# EAGLE design petdoor_ctrl (EAGLE 5.09)
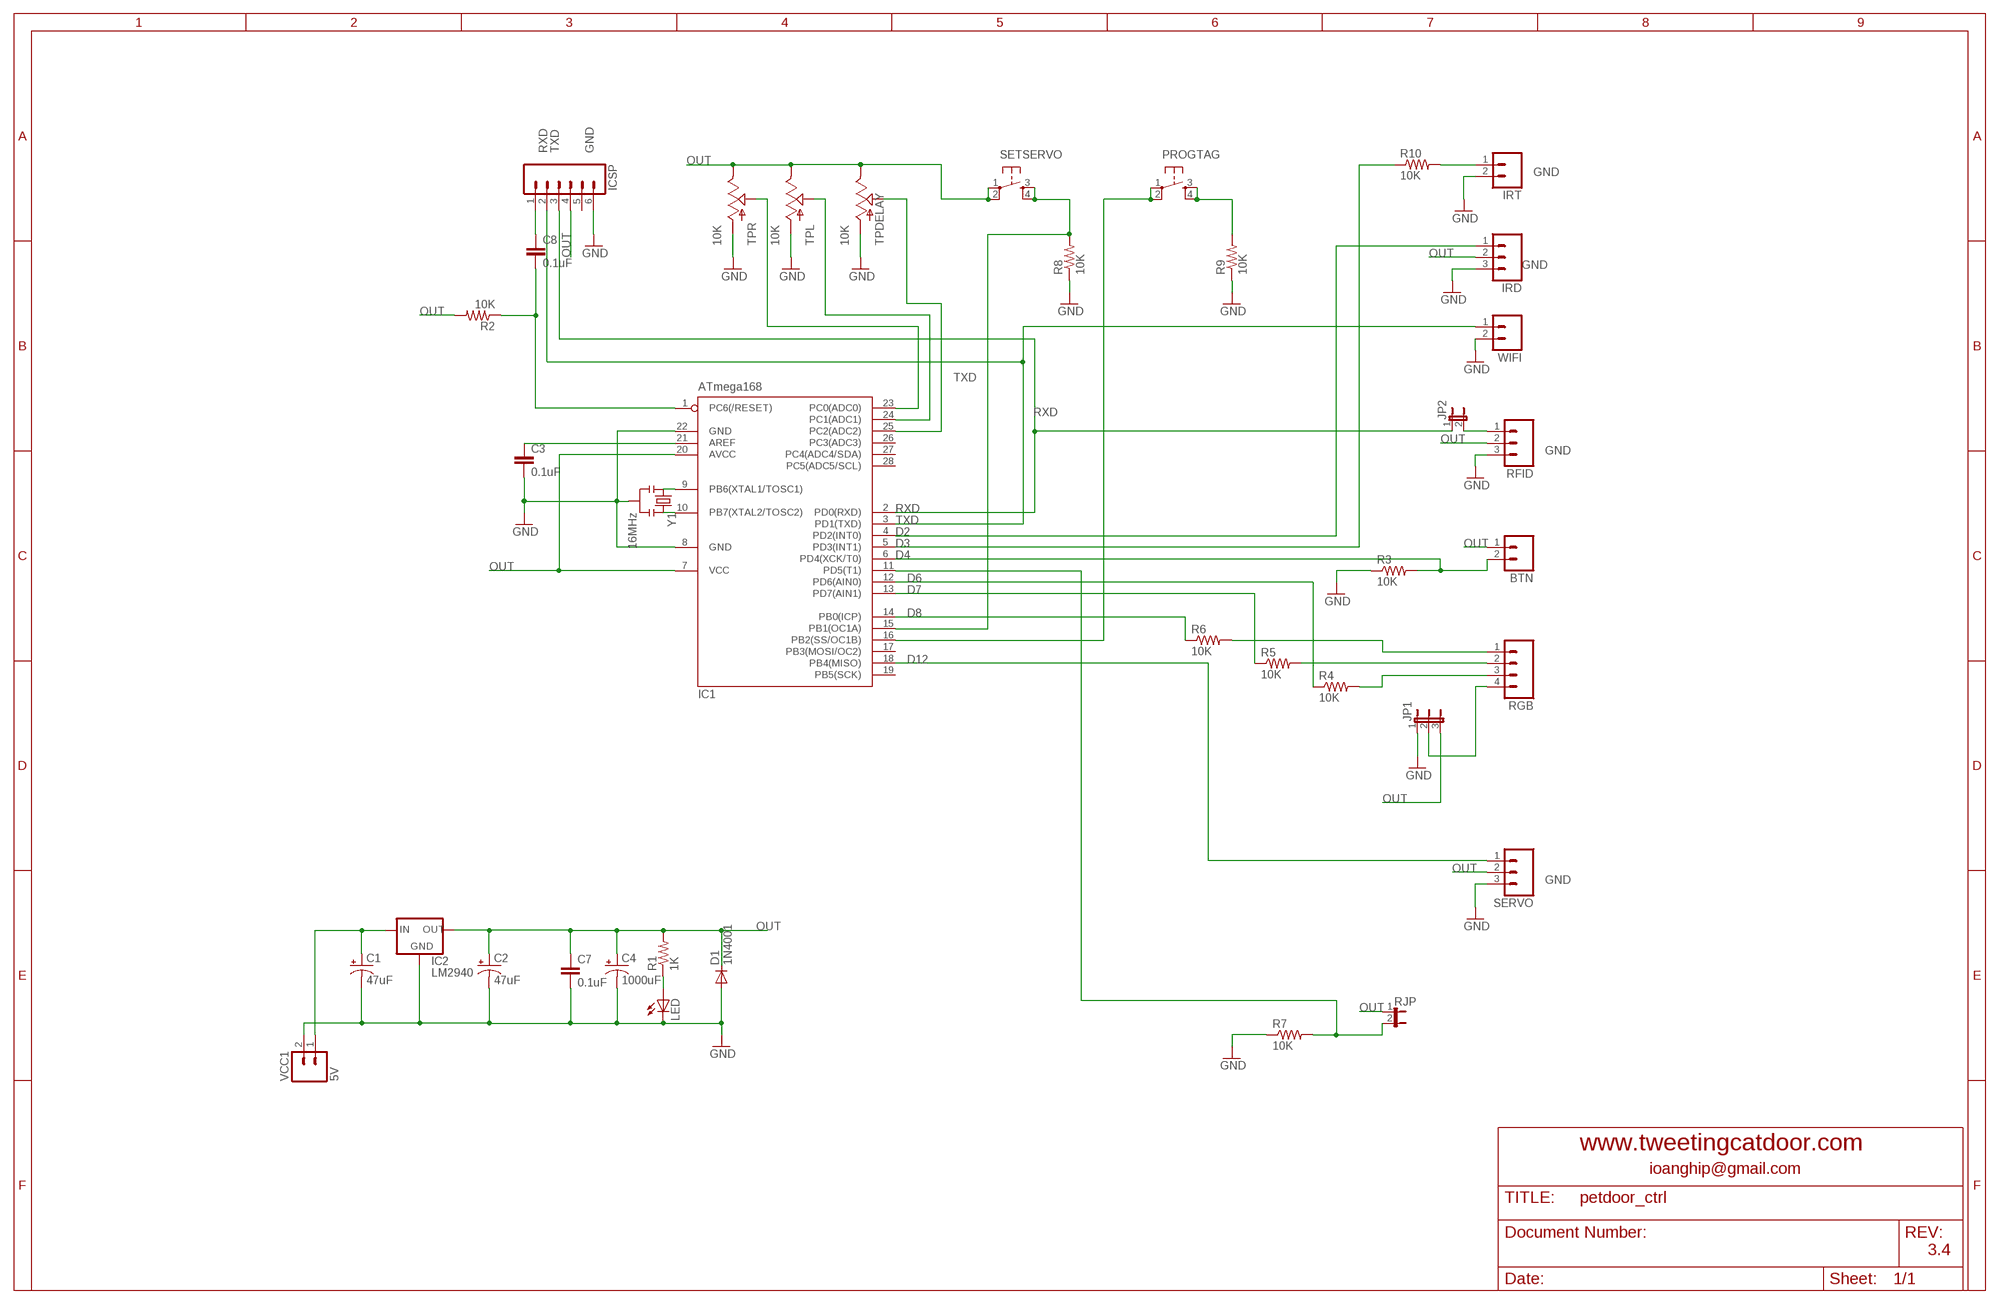
[diagram p0: schematic, sheet 1]

## Parts
BTN  M02POLAR_LOCK  [MOLEX-1X2_LOCK]
C1  47uF  CAP_POLPTH1  [CPOL-RADIAL-100UF-25V]
C2  47uF  CAP_POLPTH1  [CPOL-RADIAL-100UF-25V]
C3  0.1uF  CAPPTH2  [CAP-PTH-SMALL2]
C4  1000uF  CAP_POLPTH4  [CPOL-RADIAL-1000UF-25V]
C7  0.1uF  CAPPTH2  [CAP-PTH-SMALL2]
C8  0.1uF  CAPPTH2  [CAP-PTH-SMALL2]
D1  1N4001  DIODE-D-2.5  [D-2.5]
IC1  ATmega168  MEGA8-P  [DIL28-3]
IC2  LM2940  V_REG_78XXSINK  [TO220-IGO]
ICSP  M06LOCK  [1X06_LOCK]
IRD  M03POLAR  [MOLEX-1X3]
IRT  M02POLAR_LOCK  [MOLEX-1X2_LOCK]
JP1  JP2E  [JP2]
JP2  JP1E  [JP1]
LED  LED3MM  [LED3MM]
PROGTAG  TAC_SWITCHPTH  [TACTILE-PTH]
R1  1K  R-US_0204/2V  [0204V]
R2  10K  R-US_0204/2V  [0204V]
R3  10K  R-US_0204/2V  [0204V]
R4  10K  R-US_0204/2V  [0204V]
R5  10K  R-US_0204/2V  [0204V]
R6  10K  R-US_0204/2V  [0204V]
R7  10K  R-US_0204/2V  [0204V]
R8  10K  R-US_0204/2V  [0204V]
R9  10K  R-US_0204/2V  [0204V]
R10  10K  R-US_0204/2V  [0204V]
RFID  M03POLAR  [MOLEX-1X3]
RGB  M04POLAR  [MOLEX-1X4]
RJP  JP1E  [JP1]
SERVO  M03POLAR  [MOLEX-1X3]
SETSERVO  TAC_SWITCHPTH  [TACTILE-PTH]
TPDELAY  10K  POTTRIM  [TRIM_POT]
TPL  10K  POTTRIM  [TRIM_POT]
TPR  10K  POTTRIM  [TRIM_POT]
VCC1  5V  M02POLAR  [MOLEX-1X2]
WIFI  M02POLAR_LOCK  [MOLEX-1X2_LOCK]
Y1  16MHz  RESONATORPTH  [RESONATOR-PTH]

## Nets
A0: IC1.23(PC0(ADC0)) TPR.1(S)
A1: IC1.24(PC1(ADC1)) TPL.1(S)
A2: IC1.25(PC2(ADC2)) TPDELAY.1(S)
AREF: C3.1 IC1.21(AREF)
D2: IC1.4(PD2(INT0)) IRD.1
D3: IC1.5(PD3(INT1)) R10.1
D4: BTN.2 IC1.6(PD4(XCK/T0)) R3.2
D5: IC1.11(PD5(T1)) R7.2 RJP.2
D6: IC1.12(PD6(AIN0)) R4.1
D7: IC1.13(PD7(AIN1)) R5.1
D8: IC1.14(PB0(ICP)) R6.1
D12: IC1.18(PB4(MISO)) SERVO.1
G: R5.2 RGB.2
GND: C1.2(-) C2.2(-) C3.2 C4.2(-) C7.2 D1.A IC1.8(GND) IC1.22(GND) IC2.GND ICSP.6 IRD.3 IRT.2 JP1.1 LED.K(C) R3.1 R7.1 R8.1 R9.1 RFID.3 SERVO.3 TPDELAY.3(A) TPL.3(A) TPR.3(A) VCC1.2 WIFI.2 Y1.2
N$1: IC1.9(PB6(XTAL1/TOSC1)) Y1.1
N$2: IC1.10(PB7(XTAL2/TOSC2)) Y1.3
N$3: LED.A R1.1
N$4: JP1.2 RGB.4
N$5: C8.1 ICSP.1
N$6: C8.2 IC1.1(PC6(/RESET)) R2.1
N$7: C1.1(+) IC2.IN VCC1.1
N$8: IRT.1 R10.2
N$10: IC1.15(PB1(OC1A)) R8.2 SETSERVO.3 SETSERVO.4
N$11: R4.2 RGB.3
N$12: R6.2 RGB.1
N$15: PROGTAG.3 PROGTAG.4 R9.2
N$21: JP2.2 RFID.1
OUT [fat tracks]: BTN.1 C2.1(+) C4.1(+) C7.1 D1.C IC1.7(VCC) IC1.16(PB2(SS/OC1B)) IC1.20(AVCC) IC2.OUT ICSP.4 IRD.2 JP1.3 PROGTAG.1 PROGTAG.2 R1.2 R2.2 RFID.2 RJP.1 SERVO.2 SETSERVO.1 SETSERVO.2 TPDELAY.2(E) TPL.2(E) TPR.2(E)
RXD: IC1.2(PD0(RXD)) ICSP.3 JP2.1
TXD: IC1.3(PD1(TXD)) ICSP.2 WIFI.1
Unconnected: IC1.17(PB3(MOSI/OC2)) IC1.19(PB5(SCK)) IC1.26(PC3(ADC3)) IC1.27(PC4(ADC4/SDA)) IC1.28(PC5(ADC5/SCL)) ICSP.5

## Notes on the sheet
- www.tweetingcatdoor.com
- ioanghip@gmail.com
- 3.4

## Library data of the parts
BTN IRT VCC1 WIFI = SparkFun:M02: Header 2 Standard 2-pin 0.1" header. Use with straight break away headers (SKU : PRT-00116), right angle break away headers (PRT-00553), swiss pins (PRT-00743), machine pins (PRT-00117), and female headers (PRT-00115). Molex polarized connector foot print use with SKU : PRT-08233 with associated crimp pins and housings.
C1 C2 C4 = SparkFun:CAP_POL: Capacitor Polarized These are standard SMD and PTH capacitors. Normally 10uF, 47uF, and 100uF in electrolytic and tantalum varieties. Always verify the external diameter of the through hole cap, it varies with capacity, voltage, and manufacturer. The EIA devices should be standard.
C3 C7 C8 = SparkFun:CAP: Capacitor Standard 0603 ceramic capacitor, and 0.1" leaded capacitor.
D1 = diode:DIODE-: DIODE
IC1 = atmel:MEGA8-P: MICROCONTROLLER 8 Kbytes FLASH, 1 kbytes SRAM, 512 bytes EEPROM, USART, 4-channel 10 bit ADC, 2-channel 8 bit ADC Pin compatible with Atmega48, ATMega88, ATMega168 Source: avr.lbr
IC2 = SparkFun:V_REG_78XX: Voltage Regulator Standard 7805 5V regulator. IGO (Input Ground Output). Spark Fun Electronics SKU : COM-00107
ICSP = SparkFun:M06: Header 6 Standard 6-pin 0.1" header. Use with straight break away headers (SKU : PRT-00116), right angle break away headers (PRT-00553), swiss pins (PRT-00743), machine pins (PRT-00117), and female headers (PRT-00115). Molex polarized connector foot print use with SKU : PRT-08094 with associated crimp pins and housings. NOTES ON THE VARIANTS LOCK and LOCK_LONGPADS... This footprint was designed to help hold the alignment of a through-hole component (i.e. 6-pin header) while soldering it into place. You may notice that each hole has been shifted either up or down by 0.005 of an inch from it's more standard position (which is a perfectly straight line). This slight alteration caused the pins (the squares in the middle) to touch the edges of the holes. Because they are alternating, it causes a "brace" to hold the component in place. 0.005 has proven to be the perfect amount of "off-center" position when using our standard breakaway headers. Although looks a little odd when you look at the bare footprint, once you have a header in there, the alteration is very hard to notice. Also, if you push a header all the way into place, it is covered up entirely on the bottom side. This idea of altering the position of holes to aid alignment will be further integrated into the Sparkfun Library for other footprints. It can help hold any component with 3 or more connection pins.
IRD RFID SERVO = SparkFun:M03: Header 3 Standard 3-pin 0.1" header. Use with straight break away headers (SKU : PRT-00116), right angle break away headers (PRT-00553), swiss pins (PRT-00743), machine pins (PRT-00117), and female headers (PRT-00115). Molex polarized connector foot print use with SKU : PRT-08232 with associated crimp pins and housings.
JP1 = jumper:JP2E: JUMPER
JP2 RJP = jumper:JP1E: JUMPER
LED = SparkFun:LED: LEDs Standard schematic elements and footprints for 5mm, 3mm, 1206, and 0603 sized LEDs. 5mm - Spark Fun Electronics SKU : COM-00529 (and others)
PROGTAG SETSERVO = SparkFun:TAC_SWITCH: Momentary Switch Button commonly used for reset or general input. Spark Fun Electronics SKU : COM-00097
R1-R10 = resistor:R-US_: RESISTOR, American symbol
RGB = SparkFun:M04: Header 4 Standard 4-pin 0.1" header. Use with straight break away headers (SKU : PRT-00116), right angle break away headers (PRT-00553), swiss pins (PRT-00743), machine pins (PRT-00117), and female headers (PRT-00115). Molex polarized connector foot print use with SKU : PRT-08231 with associated crimp pins and housings.
TPDELAY TPL TPR = SparkFun:POT
Y1 = SparkFun:RESONATOR: Resonator Small SMD resonator. This is the itty bitty 10/20MHz resonators with built in caps. CSTCE10M0G55 and CSTCE20M0V53. Footprint has been reviewed closely but hasn't been tested yet.

## Net classes
0 default: width 0.406 mm, drill 0.33 mm, clearance 0.305 mm
1 fat tracks: width 0.635 mm, drill 0.33 mm, clearance 0.305 mm

## Board
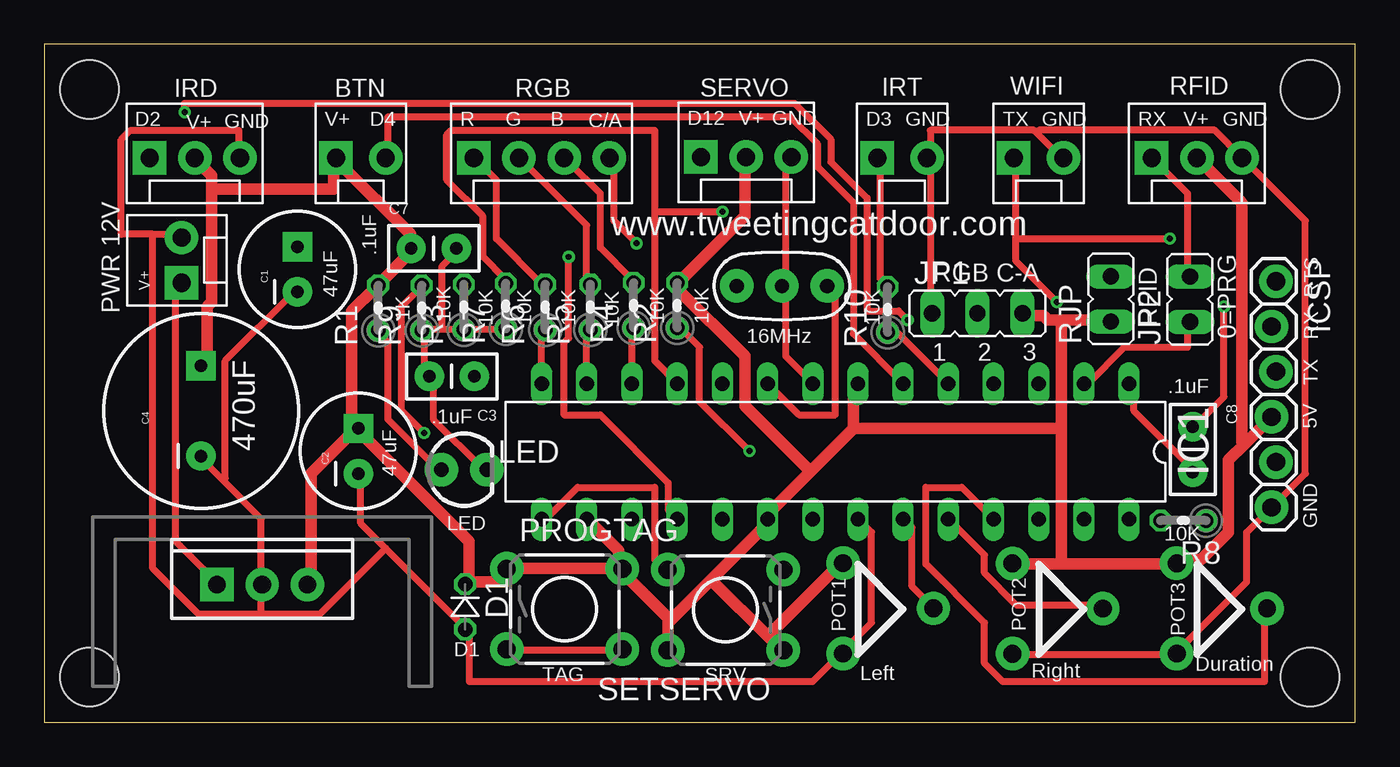
[diagram p1: board, top side]
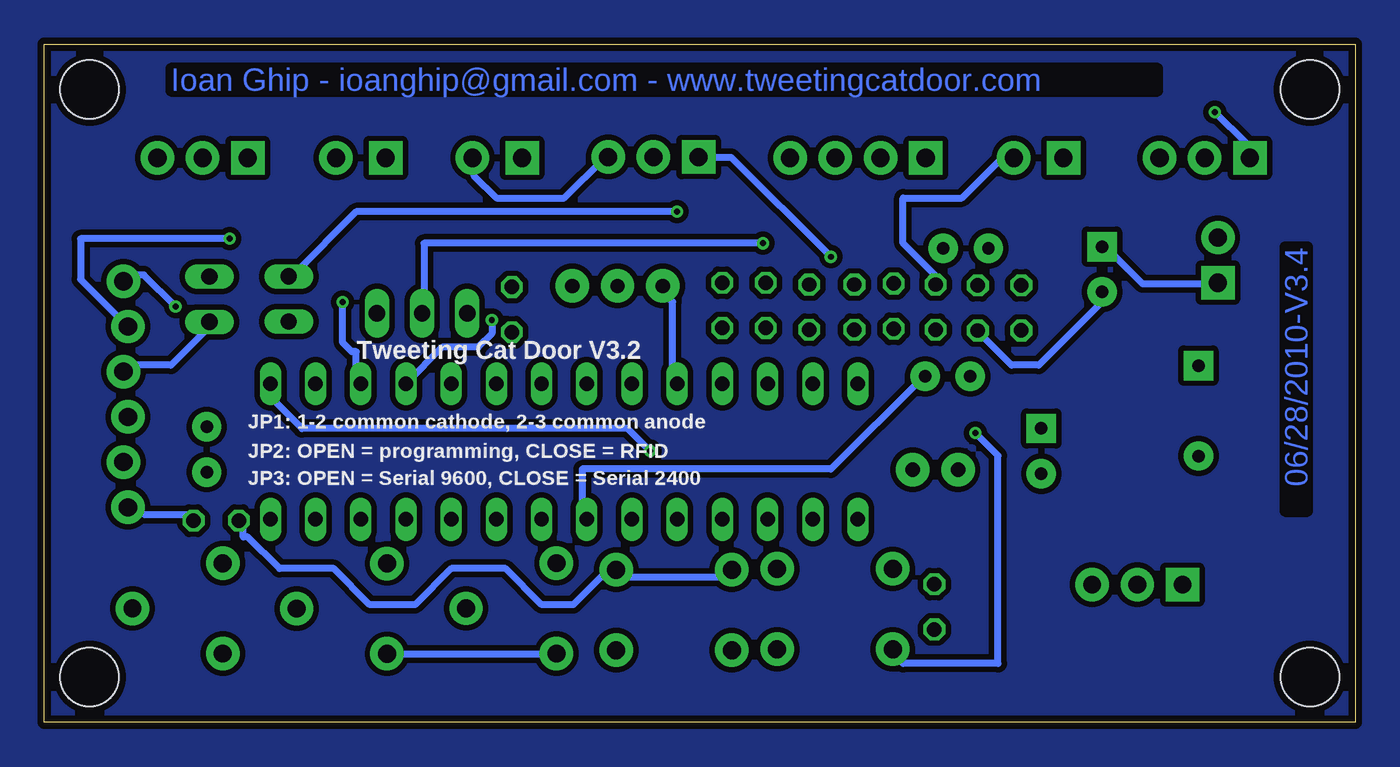
[diagram p2: board, bottom side, seen from below]

Size 73.66 x 38.1 mm. Coordinates in mm from the lower left corner, seen from the top.
Outline: 73.66,0 73.66,38.1 0,38.1 0,0 73.66,0
Copper layers (1*16): Top 0.0356mm / dielectric 1.5011mm / Bottom 0.0356mm
Design rules "LaenPCBOrder": minimum track width 6mil, minimum drill 13mil, track to track 6mil, track to pad 6mil, pad to pad 6mil, via to via 6mil, smd to smd 6mil, copper to edge 15mil, drill to drill 6mil, minimum pad ring 7mil, minimum via ring 7mil, stop-mask expansion 4mil, vias tented up to drill 0mil, thermal gap 10mil

### Footprints (pad centres in the part's own frame; a part is rotated, then mirrored left to right if it is on the bottom)
MOLEX-1X2_LOCK = drill 1.016 pad 1.88 square: 1 -0.127,0 | drill 1.016 pad 1.88 round: 2 2.667,0
CPOL-RADIAL-100UF-25V = drill 0.7 pad 1.651 square: 1 1.27,0 | drill 0.7 pad 1.651 round: 2 -1.27,0
CAP-PTH-SMALL2 = drill 0.7 pad 1.651 round: 1 0,0; 2 2.54,0
CPOL-RADIAL-1000UF-25V = drill 0.7 pad 1.651 square: 1 2.54,0 | drill 0.7 pad 1.651 round: 2 -2.54,0
D-2.5 = drill 0.813 octagon: A 1.27,0; C -1.27,0
DIL28-3 = drill 0.813 long: 1 -16.51,-3.81; 2 -13.97,-3.81; 3 -11.43,-3.81; 4 -8.89,-3.81; 5 -6.35,-3.81; 6 -3.81,-3.81; 7 -1.27,-3.81; 8 1.27,-3.81; 9 3.81,-3.81; 10 6.35,-3.81; 11 8.89,-3.81; 12 11.43,-3.81; 13 13.97,-3.81; 14 16.51,-3.81; 15 16.51,3.81; 16 13.97,3.81; 17 11.43,3.81; 18 8.89,3.81; 19 6.35,3.81; 20 3.81,3.81; 21 1.27,3.81; 22 -1.27,3.81; 23 -3.81,3.81; 24 -6.35,3.81; 25 -8.89,3.81; 26 -11.43,3.81; 27 -13.97,3.81; 28 -16.51,3.81
TO220-IGO = drill 1 pad 1.88 round: GND 0,0; OUT 2.54,0 | drill 1 pad 1.88 square: IN -2.54,0
1X06_LOCK = drill 1.016 pad 1.88 round: 1 0,0; 2 2.54,-0.254; 3 5.08,0; 4 7.62,-0.254; 5 10.16,0; 6 12.7,-0.254
MOLEX-1X3 = drill 1.016 pad 1.88 square: 1 0,0 | drill 1.016 pad 1.88 round: 2 2.54,0; 3 5.08,0
JP2 = drill 0.914 long: 1 -2.54,0; 2 0,0; 3 2.54,0
JP1 = drill 0.914 long: 1 0,-1.27; 2 0,1.27
LED3MM = drill 0.813 pad 1.88 round: A -1.27,0; K 1.27,0
TACTILE-PTH = drill 1.016 pad 1.88 round: 1 -3.251,2.261; 2 3.251,2.261; 3 -3.251,-2.261; 4 3.251,-2.261
0204V = drill 0.813 octagon: 1 -1.27,0; 2 1.27,0
MOLEX-1X4 = drill 1.016 pad 1.88 square: 1 0,0 | drill 1.016 pad 1.88 round: 2 2.54,0; 3 5.08,0; 4 7.62,0
TRIM_POT = drill 1 pad 1.88 round: 1 5.08,0; 2 0,2.54; 3 0,-2.54
STAND-OFF = hole 3.302: 0,0
MOLEX-1X2 = drill 1.016 pad 1.88 square: 1 0,0 | drill 1.016 pad 1.88 round: 2 2.54,0
RESONATOR-PTH = drill 0.8 pad 1.88 round: 1 -2.54,0; 2 0,0; 3 2.54,0

### Placement (x,y rotation side)
BTN  16.51,31.72 0 top
C1  14.22,25.46 90 top
C2  17.63,15.24 90 top
C3  24.17,19.44 180 top
C4  8.8,17.5 90 top
C7  20.61,26.64 0 top
C8  64.54,16.6 270 top
D1  23.65,6.48 270 top
IC1  44.45,15.21 180 top
IC2  12.23,7.73 0 top
ICSP  69.22,24.78 270 top
IRD  5.9,31.72 0 top
IRT  46.94,31.72 0 top
JP1  52.44,22.98 0 top
JP2  64.38,23.78 0 top
LED  23.59,14.19 0 top
PROGTAG  29.23,6.36 0 top
R1  18.76,23.29 90 top
R2  35.56,23.43 90 top
R3  23.58,23.33 90 top
R4  33.12,23.43 90 top
R5  30.68,23.33 90 top
R6  28.14,23.33 90 top
R7  25.93,23.39 90 top
R8  64.01,11.33 180 top
R9  21.2,23.29 90 top
R10  47.39,23.19 90 top
RFID  62.23,31.72 0 top
RGB  24.13,31.72 0 top
RJP  59.93,23.79 0 top
SERVO  36.9,31.77 0 top
SETSERVO  38.28,6.31 180 top
TPDELAY  63.64,6.39 0 top
TPL  54.41,6.38 0 top
TPR  44.88,6.4 0 top
U$1  [STAND-OFF]  2.54,35.56 0 top
U$2  [STAND-OFF]  71.12,35.56 0 top
U$3  [STAND-OFF]  71.12,2.54 0 top
U$4  [STAND-OFF]  2.54,2.54 0 top
VCC1  7.71,24.7 90 top
WIFI  54.61,31.72 0 top
Y1  41.45,24.52 180 top

### Tracks (layer width: path | path; a pad name or v marks a point on that pad's centre or on a via)
A0
  Top 0.406: IC1.23 48.51,11.18 48.77,10.92 48.77,7.62 49.78,6.6 TPR.1
A1
  Top 0.406: IC1.24 51.05,11.18 52.83,9.4 52.83,8.38 54.61,6.6 59.44,6.6 TPL.1
A2
  Top 0.406: IC1.25 53.34,11.43 51.56,13.21 49.53,13.21 49.53,8.89 52.83,5.59 52.83,3.3 53.85,2.29 68.58,2.29 68.58,6.35 TPDELAY.1
AREF
  Bottom 0.406: IC1.21 43.43,11.43 43.43,14.22 29.46,14.22 24.38,19.3 C3.1
D2  (via drill 0.33)
  Top 0.406: v48.51,22.61 48.01,23.11 46.23,23.11 46.23,29.46 44.2,31.5 44.2,32.77 42.16,34.8 7.87,34.8 v7.87,34.29
  Bottom 0.406: v48.51,22.61 48.51,21.84 49.28,21.08 51.31,21.08 53.34,19.05 IC1.4 | v7.87,34.29 6.1,32.51 6.1,31.75 IRD.1
D3
  Top 0.406: R10.1 47.5,21.84 48.01,21.84 50.8,19.05 IC1.5
D4
  Top 0.406: IC1.6 48.26,19.05 45.47,21.84 45.47,29.21 43.43,31.24 43.43,32.51 41.91,34.04 19.3,34.04 19.3,31.75 BTN.2
  Bottom 0.406: R3.2 23.62,24.64 23.62,25.15 25.4,26.92 25.4,29.46 22.1,29.46 19.81,31.75 19.3,31.75 BTN.2
D5  (via drill 0.33)
  Top 0.406: 34.29,28.7 34.29,20.32 35.56,19.05 IC1.11 | 34.29,28.7 34.29,33.27 22.86,33.27 22.61,33.02 22.61,30.48 24.64,28.45 24.64,26.16 25.91,24.89 R7.2 | 34.29,28.7 v38.1,28.7
  Bottom 0.406: v38.1,28.7 56.13,28.7 59.69,25.15 RJP.2
D6
  Top 0.406: IC1.12 33.02,19.05 33.02,22.1 R4.1
D7
  Top 0.406: IC1.13 30.48,19.05 30.48,21.84 R5.1
D8
  Top 0.406: IC1.14 27.94,19.05 27.94,21.84 R6.1
D12  (via drill 0.33)
  Top 0.406: v29.46,26.16 29.46,21.59 29.21,21.34 29.21,17.27 31.24,17.27 35.05,13.46 35.05,11.94 35.56,11.43 IC1.18
  Bottom 0.406: v29.46,26.16 35.05,31.75 36.83,31.75 SERVO.1
G
  Top 0.406: R5.2 30.48,24.64 30.48,27.94 26.92,31.5 RGB.2
GND
  Top 0.406: TPL.3 54.61,3.81 63.5,3.81 TPDELAY.3 63.75,4.06 67.56,7.87 67.56,10.67 68.83,11.94 ICSP.6 69.09,12.19 70.87,13.97 70.87,28.19 67.56,31.5 RFID.3 67.31,31.75 65.79,33.27 55.88,33.27 55.75,33.15 | IC1.8 43.18,19.05 41.66,20.57 41.66,24.38 Y1.2 41.66,24.64 41.66,31.5 41.91,31.75 SERVO.3 | JP1.1 49.78,23.11 49.78,31.5 IRT.2 49.78,31.75 49.78,33.27 55.63,33.27 55.75,33.15 | 55.75,33.15 57.15,31.75 WIFI.2 | IC1.22 45.97,11.18 46.48,10.67 46.48,5.59 44.96,4.06 TPR.3 44.7,3.81 43.18,2.29 23.88,2.29 23.88,5.08 D1.A 23.62,5.33 19.18,9.78 | 19.18,9.78 17.78,11.18 17.78,13.97 C2.2 | 22.35,22.1 23.37,22.1 R3.1 23.62,22.1 25.91,22.1 R7.1 | 22.35,22.1 21.34,22.1 R9.1 21.34,21.84 21.34,19.81 21.59,19.56 C3.2 21.84,19.3 21.84,17.02 24.64,14.22 LED.K | 22.35,22.1 22.35,25.65 23.11,26.42 C7.2 | 6.1,27.43 4.32,27.43 4.32,32.77 4.83,33.27 10.92,33.27 10.92,31.75 IRD.3 | 6.1,27.43 7.62,27.43 VCC1.2 | 10.03,13.59 12.19,11.43 12.19,7.87 IC2.GND 12.19,7.62 12.19,6.1 | 10.03,13.59 8.89,14.73 C4.2 | C1.2 13.97,24.13 10.16,20.32 10.16,13.72 10.03,13.59 | 6.1,27.43 6.1,8.64 8.64,6.1 12.19,6.1 | 12.19,6.1 15.49,6.1 19.18,9.78
  Bottom 0.406: R8.1 65.28,11.43 65.53,11.68 68.07,11.68 68.33,11.94 68.83,11.94 ICSP.6 | SERVO.3 42.16,31.75 44.45,29.46 48.26,29.46 49.53,30.73 49.53,31.5 IRT.2 | R9.1 21.08,21.84 19.3,20.07 17.78,20.07 14.22,23.62 14.22,24.13 C1.2 | TPL.3 54.36,3.81 44.96,3.81 TPR.3
N$1
  Top 0.406: IC1.9 40.89,18.8 42.42,17.27 44.45,17.27 44.45,24.13 44.2,24.38 Y1.1
N$2
  Bottom 0.406: IC1.10 38.35,19.05 38.35,23.62 39.12,24.38 Y1.3
N$3
  Top 0.406: R1.1 18.8,21.84 19.3,21.34 19.3,17.02 22.1,14.22 LED.A
N$4  (via drill 0.33)
  Top 0.406: v33.27,26.92 32,28.19 32,31.5 RGB.4
  Bottom 0.406: v33.27,26.92 52.32,26.92 52.32,23.11 JP1.2
N$5  (via drill 0.33)
  Top 0.406: v66.29,23.37 66.29,18.29 64.77,16.76 C8.1
  Bottom 0.406: v66.29,23.37 68.07,25.15 68.83,25.15 69.09,24.89 ICSP.1
N$6  (via drill 0.33)
  Top 0.406: v39.62,15.24 36.83,18.03 36.83,21.08 35.81,22.1 R2.1 | C8.2 64.52,14.22 61.21,17.53 61.21,18.8 IC1.1
  Bottom 0.406: v39.62,15.24 40.89,16.51 59.18,16.51 60.96,18.29 60.96,18.8 IC1.1
N$7
  Top 0.406: IC2.IN 9.65,7.87 7.37,10.16 7.37,24.38 7.62,24.64 VCC1.1
  Bottom 0.406: C1.1 13.97,26.67 11.94,24.64 7.87,24.64 VCC1.1
N$8
  Top 0.406: R10.2 47.24,24.64 46.99,24.89 46.99,31.5 IRT.1
N$9
  pour Bottom (no thermals): -2.54,40.64 77.47,40.64 77.47,-3.81 -2.54,-3.81
N$10
  Top 0.406: IC1.15 28.19,11.43 29.97,13.21 34.29,13.21 34.29,9.14 34.8,8.64 SETSERVO.4
  Bottom 0.406: R8.2 62.48,11.18 62.48,10.41 62.23,10.41 60.45,8.64 57.4,8.64 55.37,6.6 52.83,6.6 50.8,8.64 47.75,8.64 45.72,6.6 43.94,6.6 42.16,8.38 41.66,8.38 SETSERVO.3 42.16,8.13 35.31,8.13 35.05,8.38 SETSERVO.4
N$11
  Top 0.406: R4.2 33.02,24.89 31.24,26.67 31.24,29.72 29.46,31.5 RGB.3
N$12
  Top 0.406: R6.2 27.94,24.64 25.4,27.18 25.4,30.48 24.38,31.5 RGB.1
N$15  (via drill 0.33)
  Top 0.406: v21.34,16.26 20.07,17.53 20.07,23.37 21.08,24.38 R9.2 | PROGTAG.4 32.26,4.06 26.16,4.06 PROGTAG.3
  Bottom 0.406: v21.34,16.26 20.07,14.99 20.07,3.3 25.4,3.3 26.16,4.06 PROGTAG.3
N$21
  Top 0.406: JP2.2 64.26,25.15 64.26,29.72 62.48,31.5 RFID.1
OUT
  Top 0.635: 57.15,22.61 59.69,22.61 RJP.1 | 57.15,22.61 56.39,22.61 56.13,22.86 55.12,22.86 JP1.3 | 57.15,8.89 63.5,8.89 TPDELAY.2 63.75,9.14 65.02,9.14 66.55,10.67 66.55,14.73 67.44,15.62 | 57.15,8.89 54.61,8.89 TPL.2 | 67.44,15.62 68.83,17.02 ICSP.4 | RFID.2 65.02,31.5 67.31,29.21 67.31,15.75 67.44,15.62 | 57.15,16.51 57.15,22.61 | 57.15,16.51 57.15,8.89 | 9.4,29.97 9.4,30.73 8.64,31.5 IRD.2 | 9.4,29.97 9.4,23.62 9.14,23.37 9.14,20.32 8.89,20.07 C4.1 | C2.1 17.53,16.51 14.99,13.97 14.99,7.87 IC2.OUT | C2.1 17.27,16.51 17.27,23.11 18.54,24.38 R1.2 18.8,24.64 20.57,26.42 C7.1 20.57,26.92 20.57,27.43 16.51,31.5 BTN.1 16.26,31.5 16.26,29.97 9.4,29.97 | IC1.16 30.73,11.18 32.26,9.65 32.26,8.64 PROGTAG.2 | PROGTAG.2 32,8.64 26.16,8.64 PROGTAG.1 25.91,8.38 25.91,7.87 23.88,7.87 D1.C 23.88,8.13 23.88,10.16 17.78,16.26 C2.1 | SERVO.2 39.37,31.75 39.37,28.45 35.81,24.89 R2.2 35.56,24.38 39.37,20.57 39.37,17.78 43.05,14.1 | 35.18,5.71 35.05,5.59 35.05,4.06 SETSERVO.2 | 35.18,5.71 37.46,8 | 37.46,8 40.64,11.18 IC1.20 40.64,11.68 43.05,14.1 | 45.47,16.51 45.47,18.54 45.72,18.8 IC1.7 | 43.05,14.1 45.47,16.51 | 40.77,4.7 41.4,4.06 SETSERVO.1 | 37.46,8 40.77,4.7 | TPR.2 44.7,8.89 40.89,5.08 40.89,4.83 40.77,4.7 | PROGTAG.2 32.51,8.38 35.18,5.71 | 45.47,16.51 57.15,16.51
RXD
  Top 0.406: IC1.2 58.67,19.05 60.71,21.08 64.26,21.08 64.26,22.35 JP2.1
  Bottom 0.406: ICSP.3 69.09,19.81 68.83,20.07 66.55,20.07 64.26,22.35 JP2.1
TXD  (via drill 0.33)
  Top 0.406: v56.9,23.62 54.61,25.91 54.61,27.18 | 54.61,27.18 54.61,31.5 WIFI.1 | 54.61,27.18 v63.25,27.18
  Bottom 0.406: v56.9,23.62 56.9,21.34 56.39,20.83 56.13,20.83 56.13,19.05 IC1.3 | v63.25,27.18 71.63,27.18 71.63,24.89 69.09,22.35 ICSP.2

### Text on the board
Bottom: Ioan Ghip - ioanghip@gmail.com - www.tweetingcatdoor.com | 06/28/2010-V3.4
tPlace: IRD | BTN | RGB | SERVO | IRT | WIFI | RFID | D12 | V+ | GND | D2 | V+ | GND | V+ | D4 | R | G | B | C/A | D3 | GND | TX | GND | RX | V+ | GND | .1uF | www.tweetingcatdoor.com | RGB C-A | 10K | V+ | 47uF | 1K | 10K | 10K | 10K | 10K | 10K | 10K | RTS | PWR 12V | 10K | RFID | 0=PRG | RX | 16MHz | TX | .1uF | .1uF | 5V | 470uF | 47uF | LED | GND | 10K | POT3 | POT1 | POT2 | D1 | Duration | TAG | SRV | Left | Right
bPlace: Tweeting Cat Door V3.2 | JP1: 1-2 common cathode, 2-3 common anode | JP2: OPEN = programming, CLOSE = RFID | JP3: OPEN = Serial 9600, CLOSE = Serial 2400